# Altium schematic sheet TCAN330_PINOUT.SchDoc
size A4; SheetNumber: 10; SheetTotal: 11
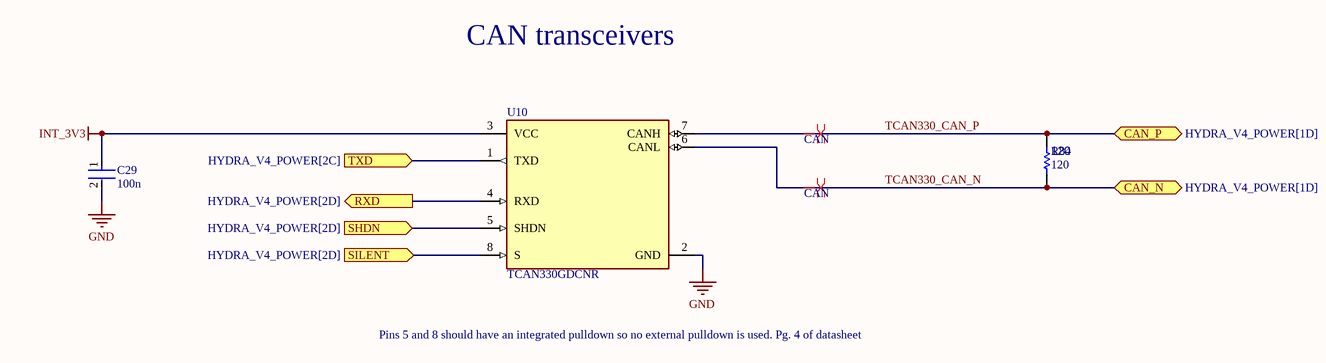
[diagram p0: TCAN330_PINOUT.SchDoc]

## Parts
C29  100n  [FP-0402-L_1_0_0_05-W_0_5-IPC_A]
R84  120  [R0603B]
U10  TCAN330GDCNR  [FP-DCN0008A-MFG]

## Ports
CAN_N (bidir, see HYDRA_V4_POWER[1D]), CAN_P (bidir, see HYDRA_V4_POWER[1D]), RXD (out, see HYDRA_V4_POWER[2D]), SHDN (in, see HYDRA_V4_POWER[2D]), SILENT (in, see HYDRA_V4_POWER[2D]), TXD (in, see HYDRA_V4_POWER[2C])

## Nets
GND: C29.2 U10.2(GND)
INT_3V3: C29.1 U10.3(VCC)
RXD: U10.4(RXD) ; port RXD
SHDN: U10.5(SHDN) ; port SHDN
SILENT: U10.8(S) ; port SILENT
TCAN330_CAN_N: R84.1 U10.6(CANL) ; port CAN_N
TCAN330_CAN_P: R84.2 U10.7(CANH) ; port CAN_P
TXD: U10.1(TXD) ; port TXD

## Layout directives
differential pair; net class CAN: TCAN330_CAN_N, TCAN330_CAN_P

## Notes on the sheet
- CAN transceivers
- Pins 5 and 8 should have an integrated pulldown so no external pulldown is used. Pg. 4 of datasheet

## Library data of the parts
C29 = CMP-001-00058-1: LARGE PADS, 0402 CAP, CHANGE COMMENT TO MATCH REAL P/N; Capacitor Type: Ceramic; Value: 100n; Min Operating Temperature: -55°C; Mounting Technology: Surface Mount; Pins: 2; Case/Package: 0402; RoHS Compliant: Yes; Max Operating Temperature: 85°C
R84 = CMP-009-00002-14: Resistor; Value: 120
U10 = CMP-04872-000178-1: IC TRANSCEIVER 1/1 SOT23-8; Data Rate: 1Mbps; Packaging: Tape and Reel; Min Operating Temperature: -40°C; Max Operating Temperature: 125°C; RoHS Compliant: Yes; Lead Free: Lead Free; Case/Package: SOT-23-8; Mount: Surface Mount